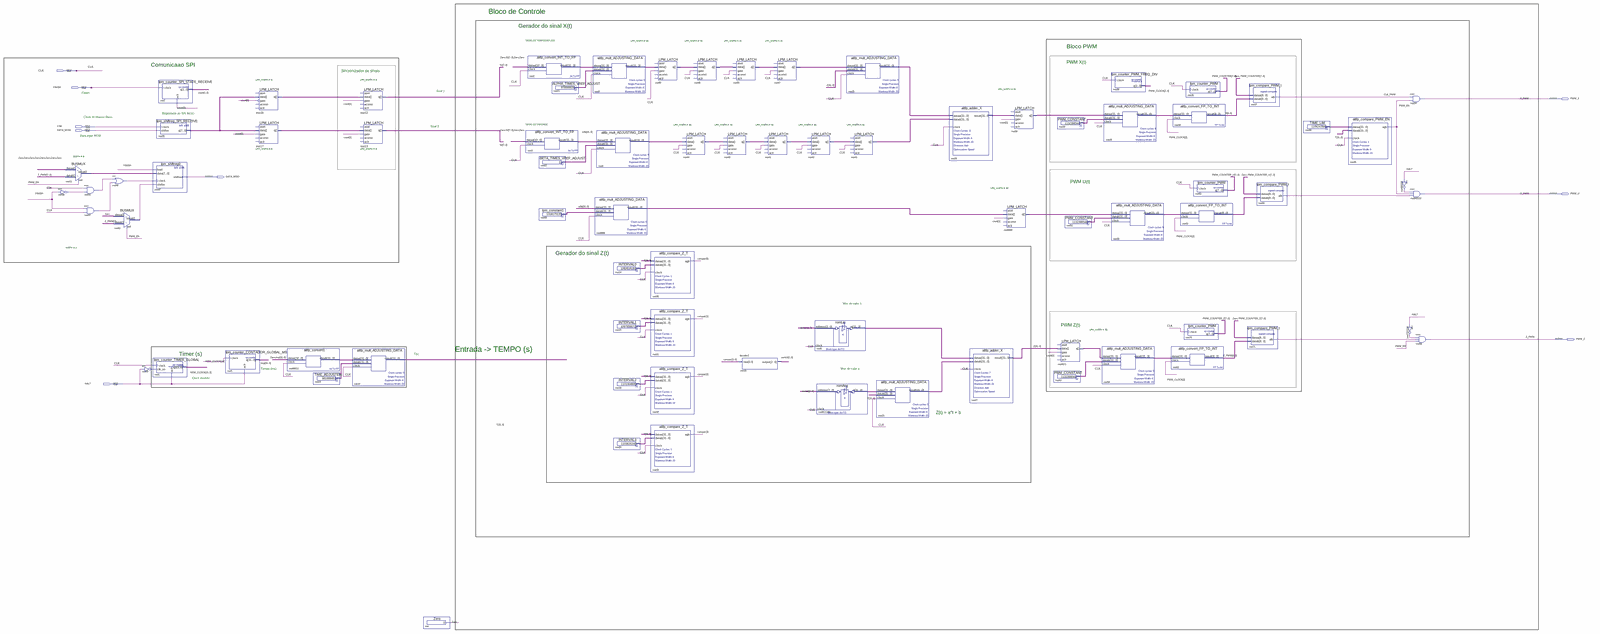
[diagram p0: schematic sheet, whole]
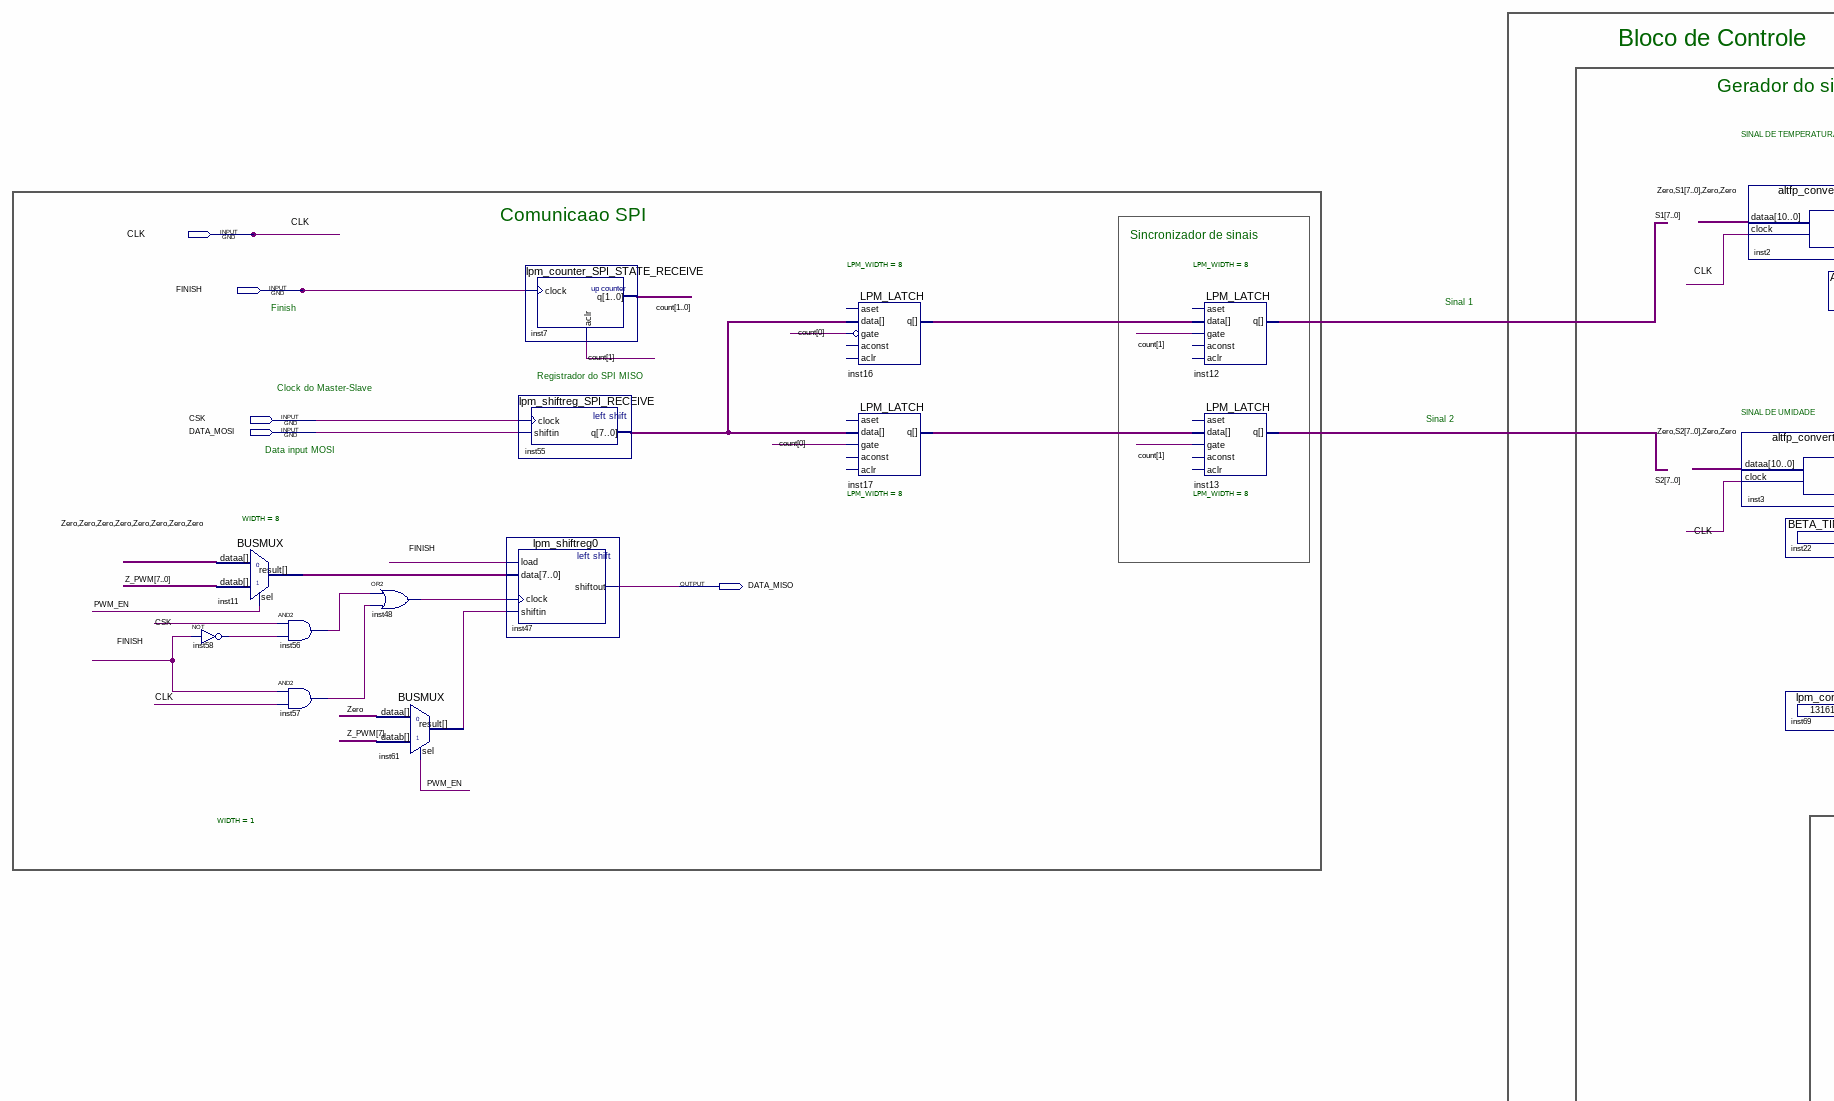
[diagram p1: schematic sheet, upper left part]
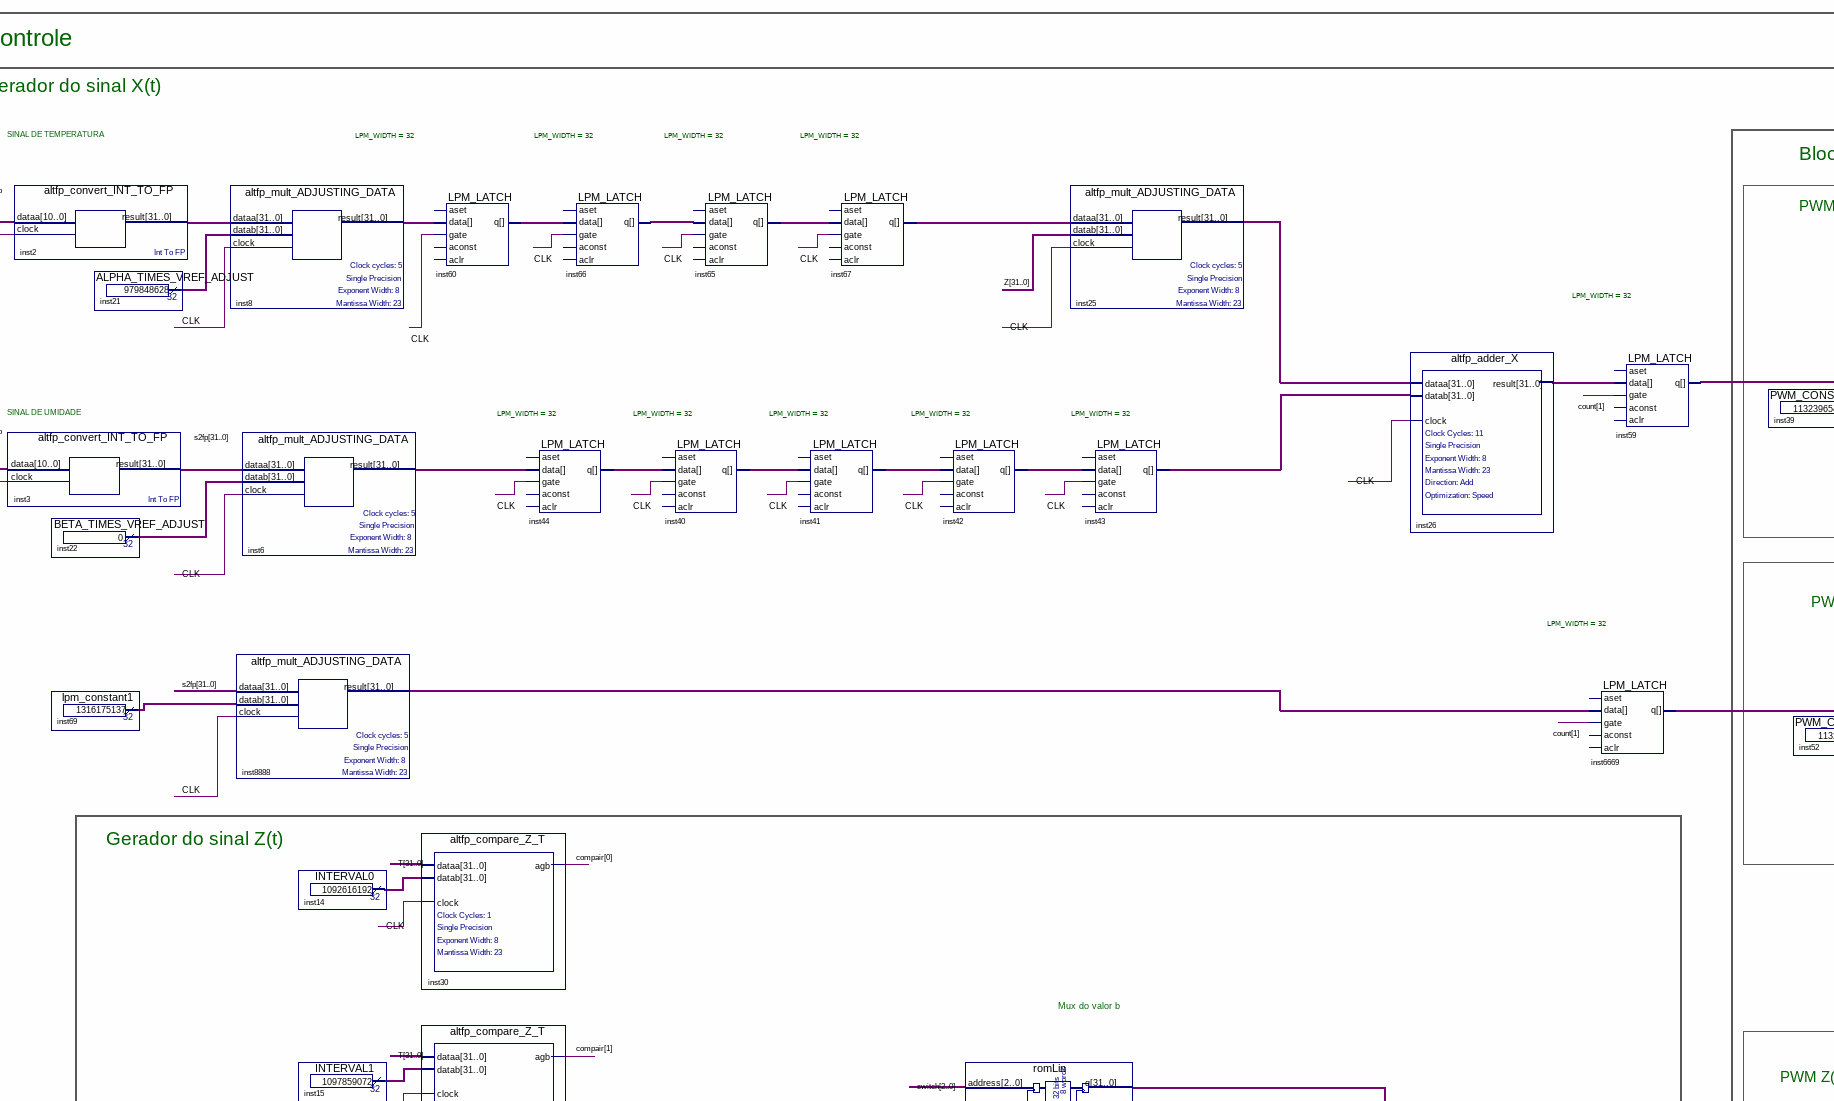
[diagram p2: schematic sheet, upper centre part]
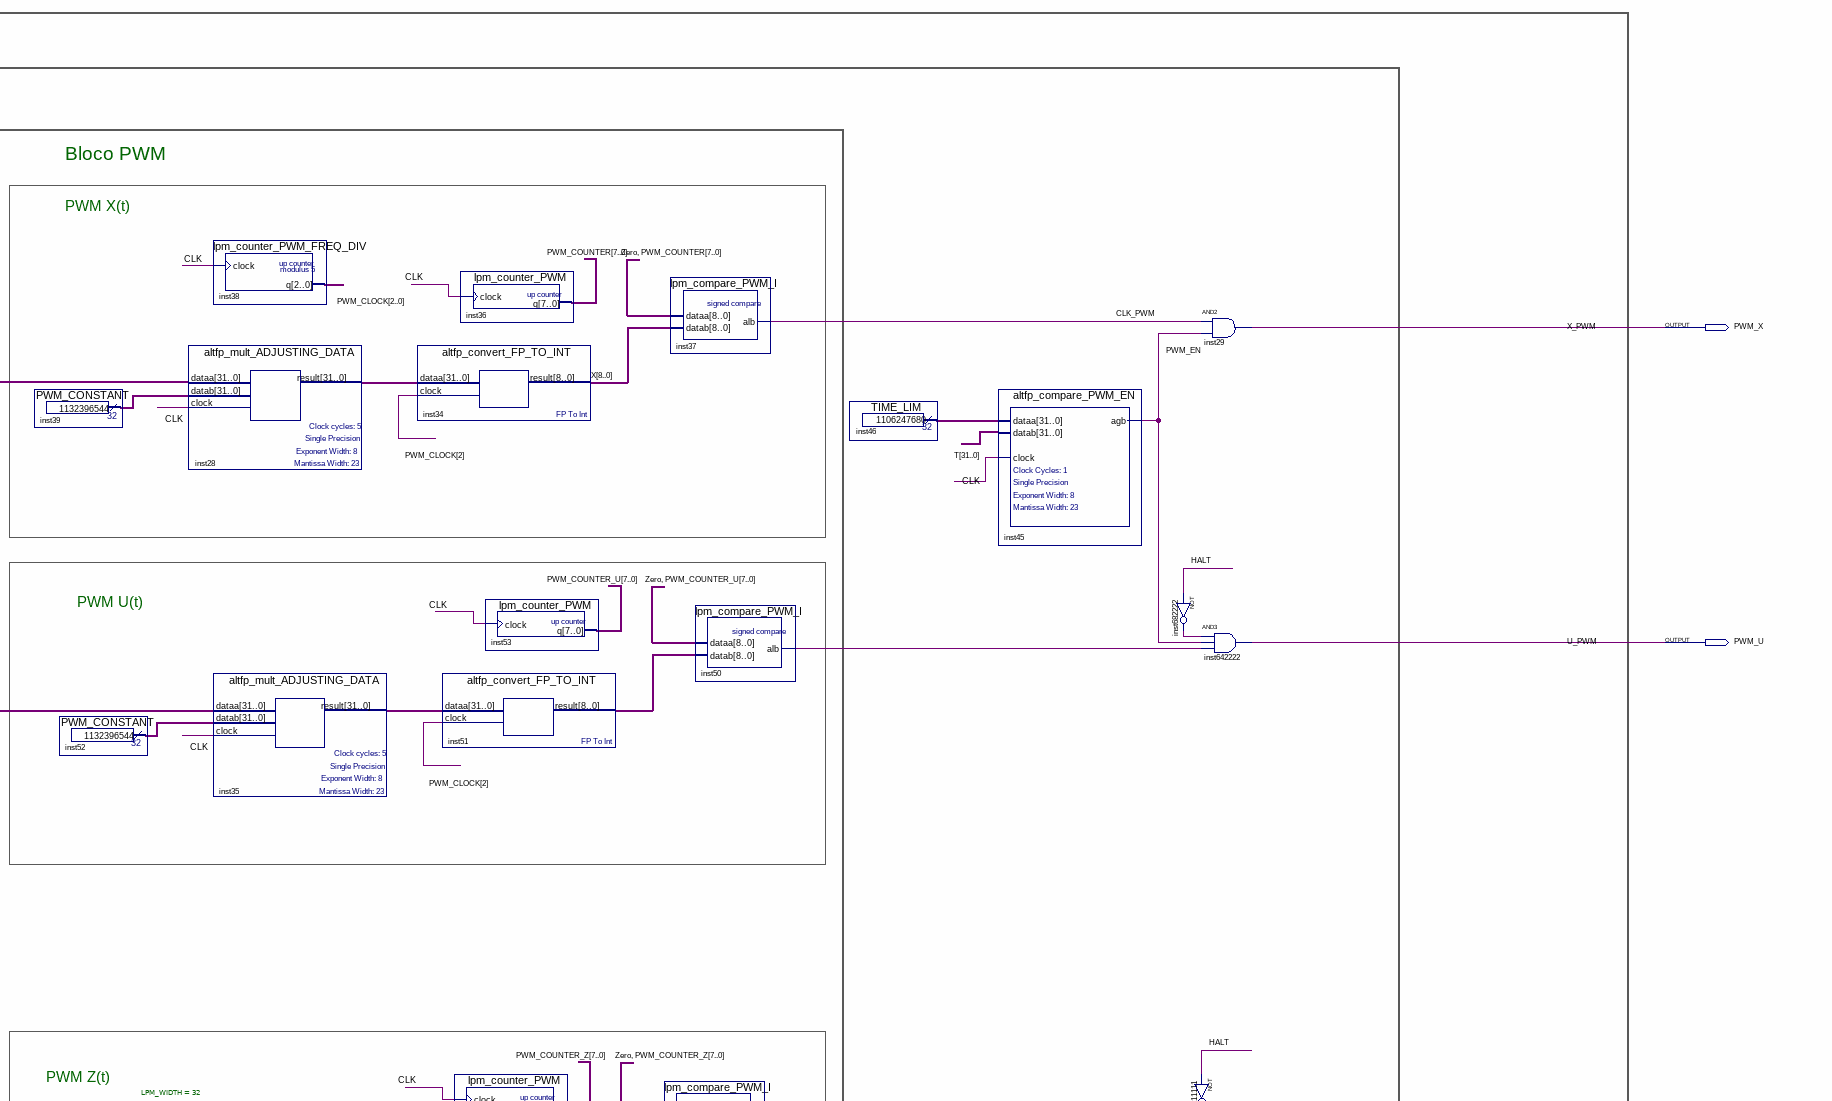
[diagram p3: schematic sheet, upper right part]
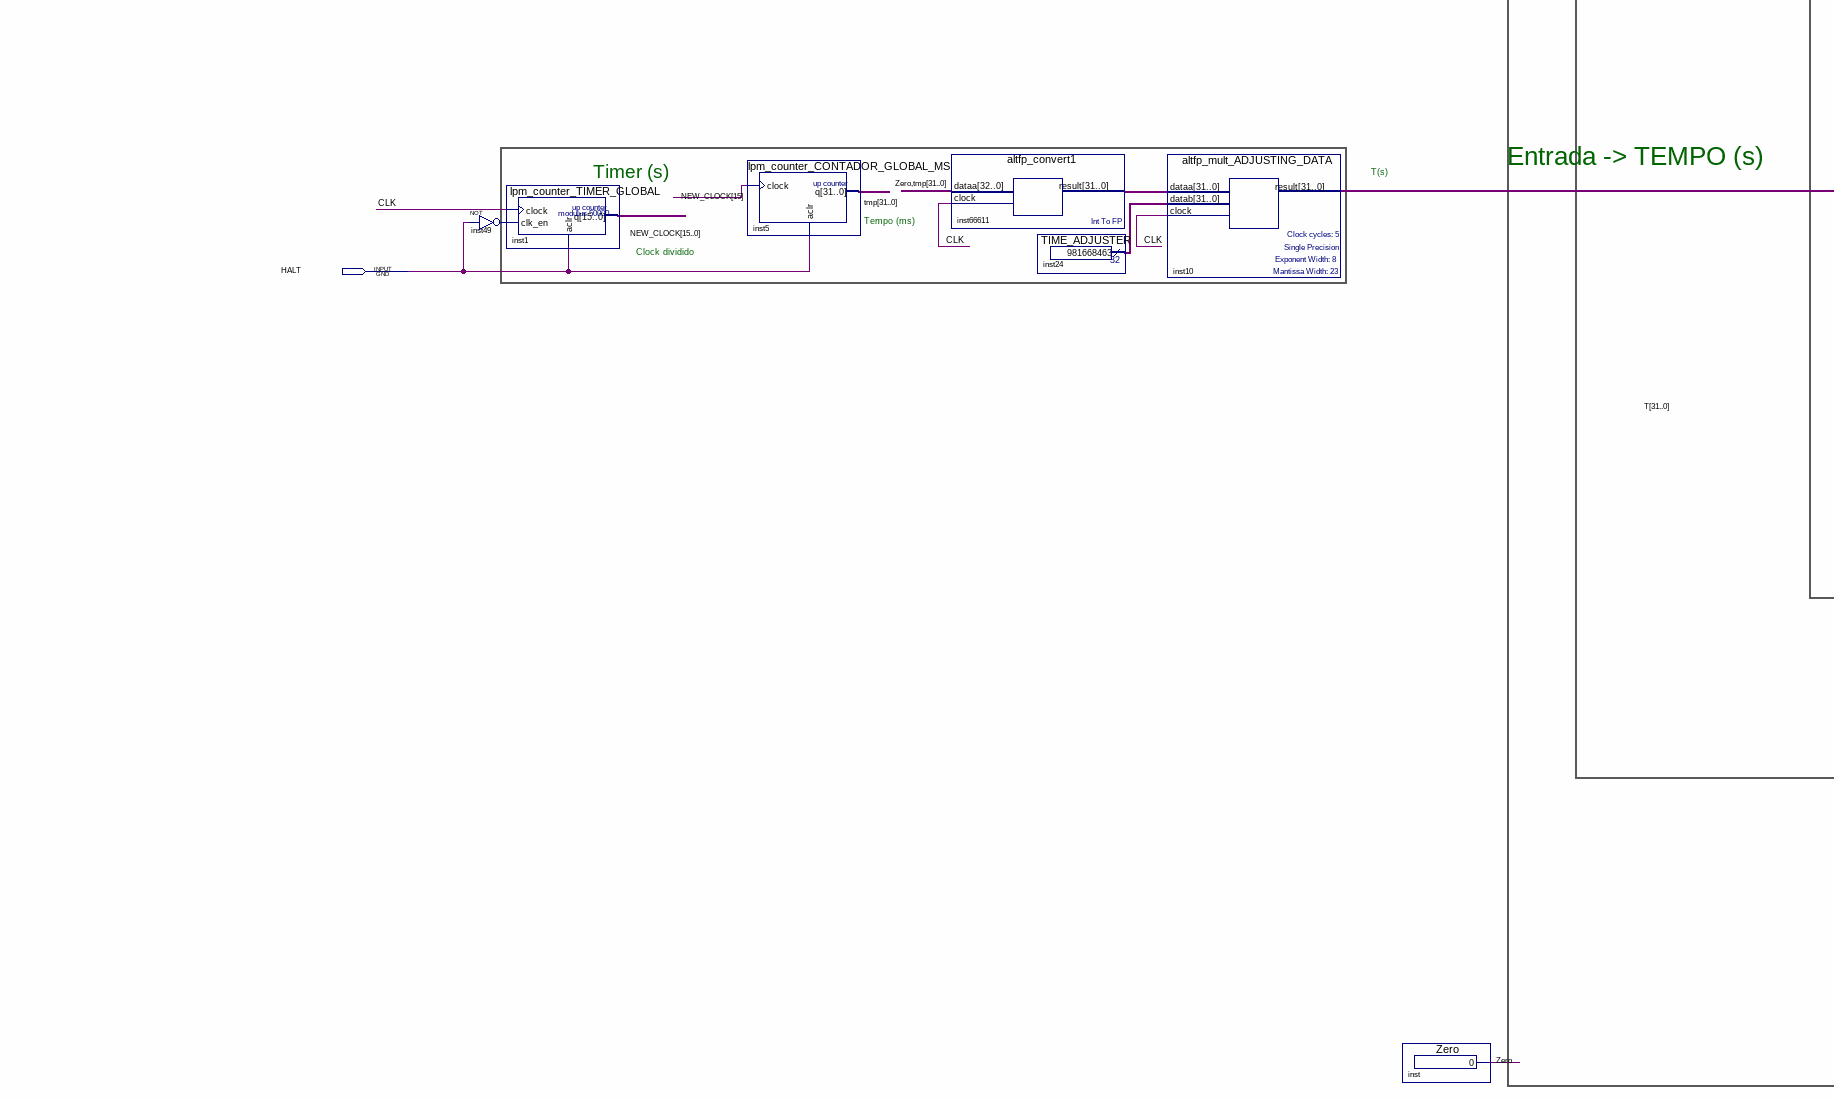
[diagram p4: schematic sheet, lower left part]
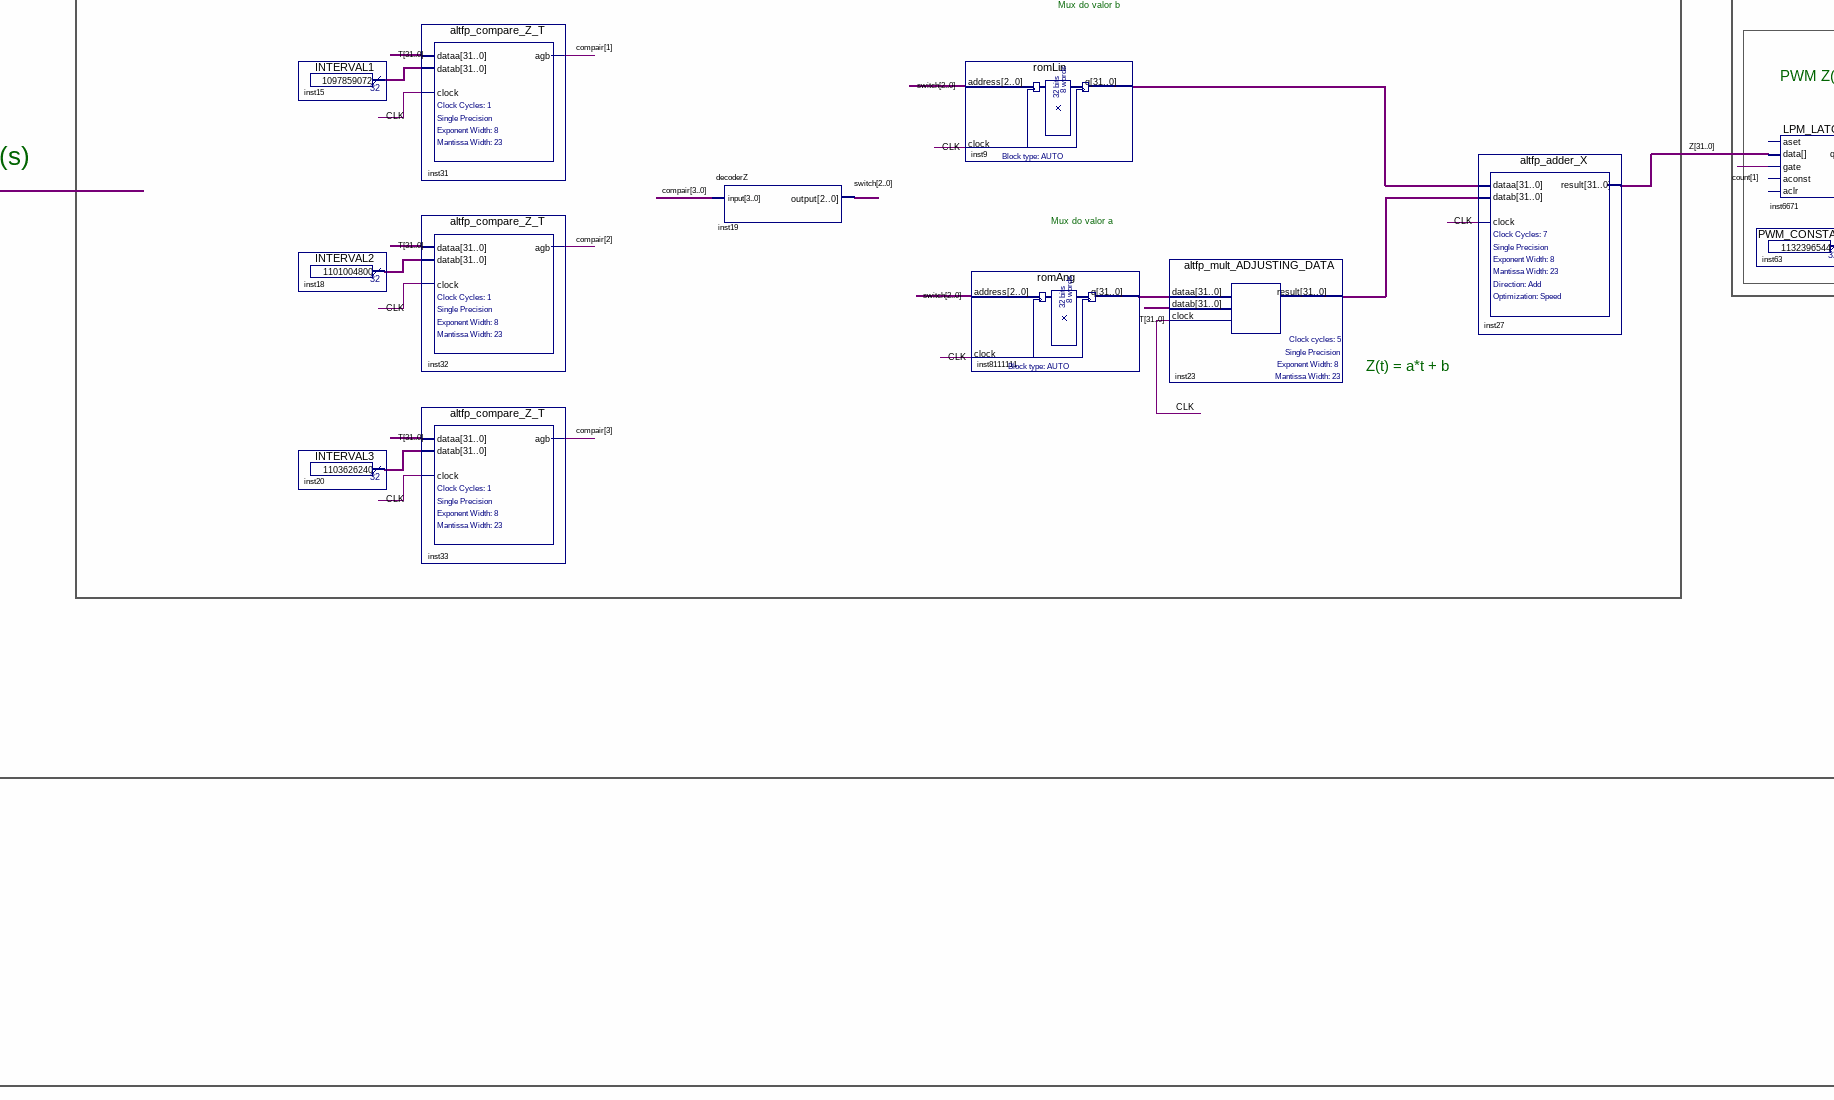
[diagram p5: schematic sheet, lower centre part]
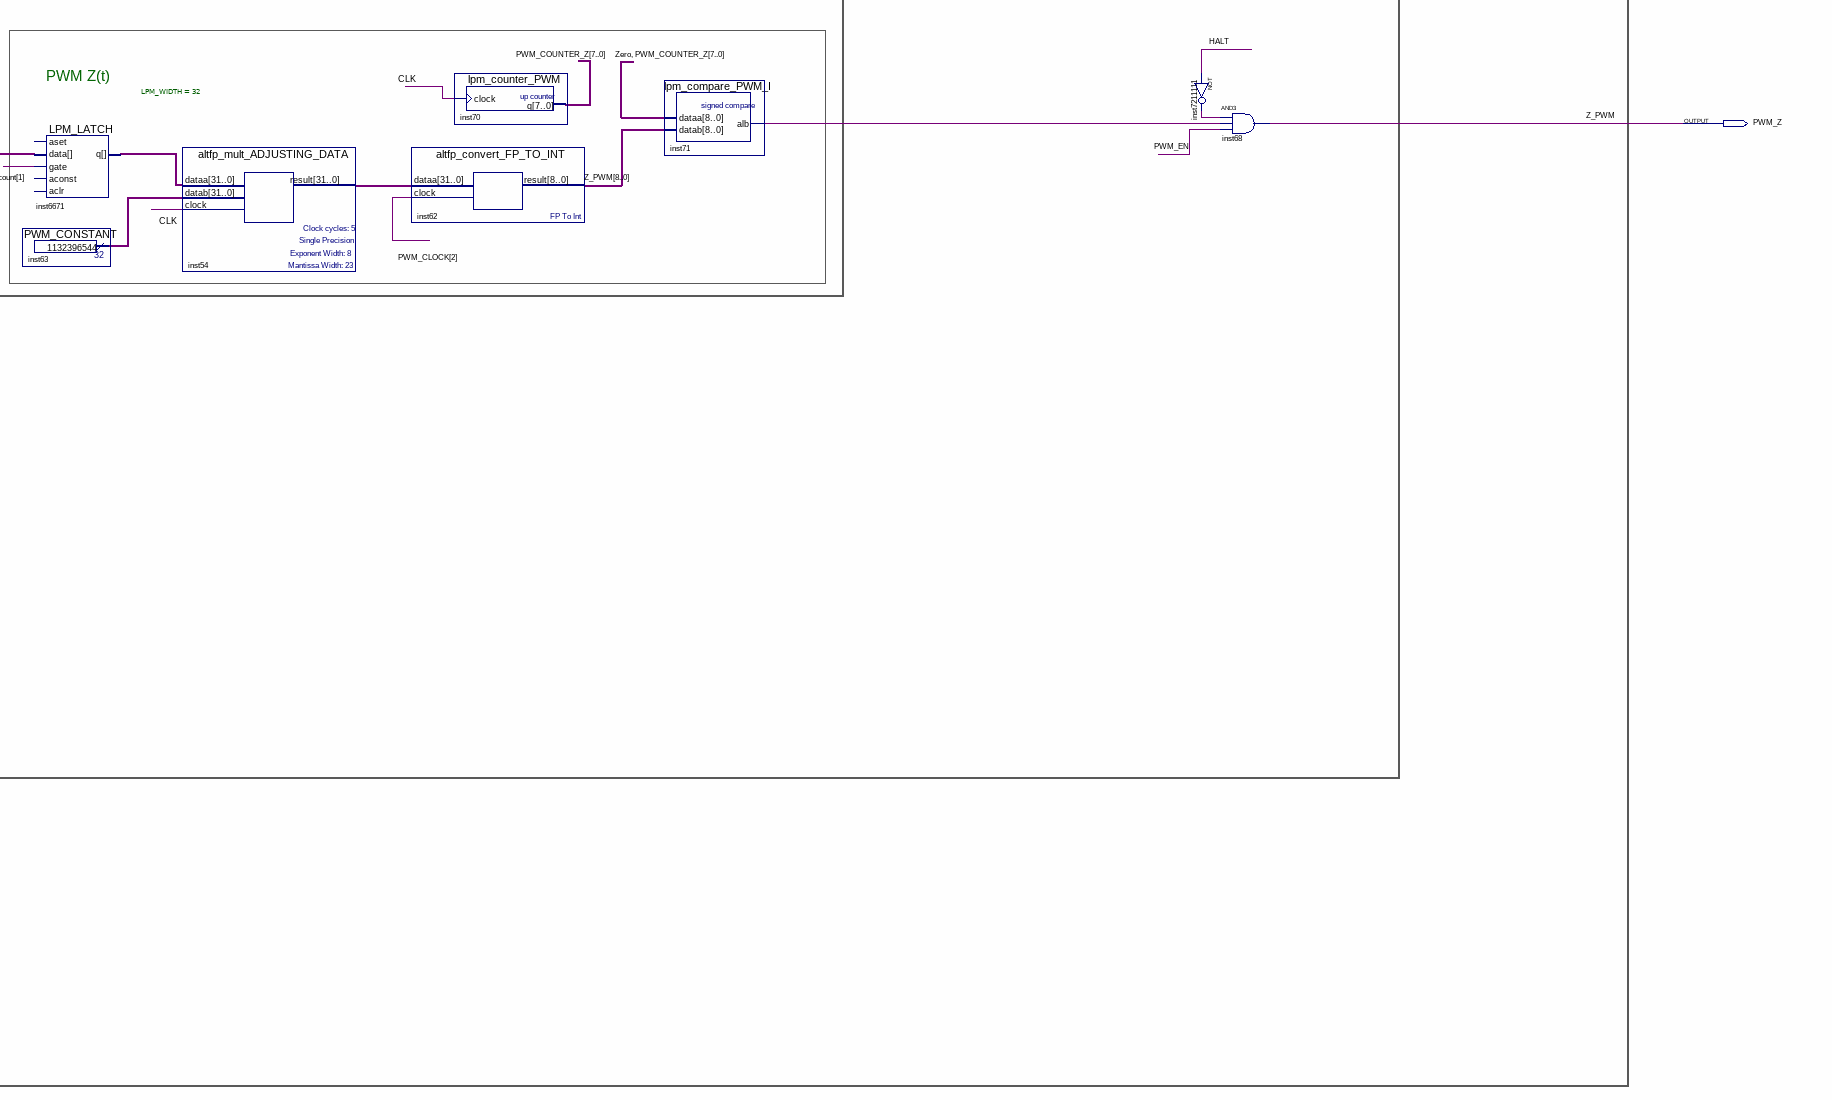
[diagram p6: schematic sheet, lower right part]
// Quartus schematic Secador.bdf as structural Verilog: 78 symbols, 9 pins
module Secador (
  input  CLK,
  input  FINISH,
  input  CSK,
  input  DATA_MOSI,
  input  HALT,
  output PWM_X,
  output DATA_MISO,
  output PWM_U,
  output PWM_Z
);

  wire CLK_PWM, inst48_out, inst49_out, inst50_alb, inst56_out, inst57_out, inst58_out, inst61_result,
       inst71_alb, inst682222_out, inst7211111_out, PWM_EN, Zero;
  wire [1:0] count;
  wire [2:0] PWM_CLOCK, switch;
  wire [3:0] compair;
  wire [7:0] inst11_result, inst16_q, inst17_q, inst55_q, PWM_COUNTER, PWM_COUNTER_U, PWM_COUNTER_Z, S1, S2;
  wire [8:0] inst51_result, X, Z_PWM;
  wire [15:0] NEW_CLOCK;
  wire [31:0] inst2_result, inst6_result, inst8_result, inst9_q, inst14_result, inst15_result, inst18_result,
       inst20_result, inst21_result, inst22_result, inst23_result, inst24_result, inst25_result,
       inst26_result, inst28_result, inst35_result, inst39_result, inst40_q, inst41_q, inst42_q, inst43_q,
       inst44_q, inst46_result, inst52_result, inst54_result, inst59_q, inst60_q, inst63_result, inst65_q,
       inst66_q, inst67_q, inst69_result, inst6669_q, inst6671_q, inst8888_result, inst66611_result,
       inst8111111_q, s2fp, T, tmp, Z;

  BUSMUX #(.WIDTH(8)) inst11 (.datab(Z_PWM[7:0]), .sel(PWM_EN), .dataa({8{Zero}}), .result(inst11_result));
  not inst58 (inst58_out, FINISH);
  and inst56 (inst56_out, CSK, inst58_out);
  and inst57 (inst57_out, FINISH, CLK);
  or inst48 (inst48_out, inst56_out, inst57_out);
  BUSMUX #(.WIDTH(1)) inst61 (.datab(Z_PWM[7]), .sel(PWM_EN), .dataa(Zero), .result(inst61_result));
  not inst49 (inst49_out, HALT);
  lpm_counter_SPI_STATE_RECEIVE inst7 (.clock(FINISH), .aclr(count[1]), .q(count));
  lpm_shiftreg_SPI_RECEIVE inst55 (.clock(CSK), .shiftin(DATA_MOSI), .q(inst55_q));
  lpm_shiftreg0 inst47 (
    .load(FINISH), .data(inst11_result), .clock(inst48_out), .shiftin(inst61_result), .shiftout(DATA_MISO));
  lpm_counter_TIMER_GLOBAL inst1 (.clock(CLK), .clk_en(inst49_out), .aclr(HALT), .q(NEW_CLOCK));
  lpm_counter_CONTADOR_GLOBAL_MS inst5 (.clock(NEW_CLOCK[15]), .aclr(HALT), .q(tmp));
  LPM_LATCH #(.LPM_WIDTH(8)) inst16 (.data(inst55_q), .gate(~count[0]), .q(inst16_q));  // open: aset, aconst, aclr
  LPM_LATCH #(.LPM_WIDTH(8)) inst17 (.data(inst55_q), .gate(count[0]), .q(inst17_q));  // open: aset, aconst, aclr
  altfp_convert1 inst66611 (.dataa({Zero, tmp}), .clock(CLK), .result(inst66611_result));
  TIME_ADJUSTER inst24 (.result(inst24_result));
  altfp_mult_ADJUSTING_DATA inst10 (.dataa(inst66611_result), .datab(inst24_result), .clock(CLK), .result(T));
  LPM_LATCH #(.LPM_WIDTH(8)) inst12 (.data(inst16_q), .gate(count[1]), .q(S1));  // open: aset, aconst, aclr
  LPM_LATCH #(.LPM_WIDTH(8)) inst13 (.data(inst17_q), .gate(count[1]), .q(S2));  // open: aset, aconst, aclr
  Zero inst (.result(Zero));
  altfp_convert_INT_TO_FP inst2 (.dataa({Zero, S1, {2{Zero}}}), .clock(CLK), .result(inst2_result));
  altfp_convert_INT_TO_FP inst3 (.dataa({Zero, S2, {2{Zero}}}), .clock(CLK), .result(s2fp));
  BETA_TIMES_VREF_ADJUST inst22 (.result(inst22_result));
  lpm_constant1 inst69 (.result(inst69_result));
  ALPHA_TIMES_VREF_ADJUST inst21 (.result(inst21_result));
  altfp_mult_ADJUSTING_DATA inst8 (.dataa(inst2_result), .datab(inst21_result), .clock(CLK), .result(inst8_result));
  altfp_mult_ADJUSTING_DATA inst6 (.dataa(s2fp), .datab(inst22_result), .clock(CLK), .result(inst6_result));
  altfp_mult_ADJUSTING_DATA inst8888 (.dataa(s2fp), .datab(inst69_result), .clock(CLK), .result(inst8888_result));
  INTERVAL0 inst14 (.result(inst14_result));
  INTERVAL1 inst15 (.result(inst15_result));
  INTERVAL2 inst18 (.result(inst18_result));
  INTERVAL3 inst20 (.result(inst20_result));
  altfp_compare_Z_T inst30 (.dataa(T), .datab(inst14_result), .clock(CLK), .agb(compair[0]));
  altfp_compare_Z_T inst31 (.dataa(T), .datab(inst15_result), .clock(CLK), .agb(compair[1]));
  altfp_compare_Z_T inst32 (.dataa(T), .datab(inst18_result), .clock(CLK), .agb(compair[2]));
  altfp_compare_Z_T inst33 (.dataa(T), .datab(inst20_result), .clock(CLK), .agb(compair[3]));
  LPM_LATCH #(.LPM_WIDTH(32)) inst60 (.data(inst8_result), .gate(CLK), .q(inst60_q));  // open: aset, aconst, aclr
  LPM_LATCH #(.LPM_WIDTH(32)) inst44 (.data(inst6_result), .gate(CLK), .q(inst44_q));  // open: aset, aconst, aclr
  LPM_LATCH #(.LPM_WIDTH(32)) inst66 (.data(inst60_q), .gate(CLK), .q(inst66_q));  // open: aset, aconst, aclr
  LPM_LATCH #(.LPM_WIDTH(32)) inst40 (.data(inst44_q), .gate(CLK), .q(inst40_q));  // open: aset, aconst, aclr
  LPM_LATCH #(.LPM_WIDTH(32)) inst65 (.data(inst66_q), .gate(CLK), .q(inst65_q));  // open: aset, aconst, aclr
  decoderZ inst19 (.\input (compair), .\output (switch));
  LPM_LATCH #(.LPM_WIDTH(32)) inst41 (.data(inst40_q), .gate(CLK), .q(inst41_q));  // open: aset, aconst, aclr
  LPM_LATCH #(.LPM_WIDTH(32)) inst67 (.data(inst65_q), .gate(CLK), .q(inst67_q));  // open: aset, aconst, aclr
  LPM_LATCH #(.LPM_WIDTH(32)) inst42 (.data(inst41_q), .gate(CLK), .q(inst42_q));  // open: aset, aconst, aclr
  romLin inst9 (.address(switch), .clock(CLK), .q(inst9_q));
  romAng inst8111111 (.address(switch), .clock(CLK), .q(inst8111111_q));
  altfp_mult_ADJUSTING_DATA inst25 (.dataa(inst67_q), .datab(Z), .clock(CLK), .result(inst25_result));
  LPM_LATCH #(.LPM_WIDTH(32)) inst43 (.data(inst42_q), .gate(CLK), .q(inst43_q));  // open: aset, aconst, aclr
  altfp_mult_ADJUSTING_DATA inst23 (.dataa(inst8111111_q), .datab(T), .clock(CLK), .result(inst23_result));
  altfp_adder_X inst26 (.dataa(inst25_result), .datab(inst43_q), .clock(CLK), .result(inst26_result));
  altfp_adder_X inst27 (.dataa(inst9_q), .datab(inst23_result), .clock(CLK), .result(Z));
  LPM_LATCH #(.LPM_WIDTH(32)) inst59 (.data(inst26_result), .gate(count[1]), .q(inst59_q));  // open: aset, aconst, aclr
  LPM_LATCH #(.LPM_WIDTH(32)) inst6669 (
    .data(inst8888_result), .gate(count[1]), .q(inst6669_q));  // open: aset, aconst, aclr
  PWM_CONSTANT inst63 (.result(inst63_result));
  PWM_CONSTANT inst39 (.result(inst39_result));
  PWM_CONSTANT inst52 (.result(inst52_result));
  LPM_LATCH #(.LPM_WIDTH(32)) inst6671 (.data(Z), .gate(count[1]), .q(inst6671_q));  // open: aset, aconst, aclr
  lpm_counter_PWM_FREQ_DIV inst38 (.clock(CLK), .q(PWM_CLOCK));
  altfp_mult_ADJUSTING_DATA inst28 (.dataa(inst59_q), .datab(inst39_result), .clock(CLK), .result(inst28_result));
  altfp_mult_ADJUSTING_DATA inst35 (.dataa(inst6669_q), .datab(inst52_result), .clock(CLK), .result(inst35_result));
  altfp_mult_ADJUSTING_DATA inst54 (.dataa(inst6671_q), .datab(inst63_result), .clock(CLK), .result(inst54_result));
  altfp_convert_FP_TO_INT inst34 (.dataa(inst28_result), .clock(PWM_CLOCK[2]), .result(X));
  altfp_convert_FP_TO_INT inst62 (.dataa(inst54_result), .clock(PWM_CLOCK[2]), .result(Z_PWM));
  lpm_counter_PWM inst36 (.clock(CLK), .q(PWM_COUNTER));
  altfp_convert_FP_TO_INT inst51 (.dataa(inst35_result), .clock(PWM_CLOCK[2]), .result(inst51_result));
  lpm_counter_PWM inst70 (.clock(CLK), .q(PWM_COUNTER_Z));
  lpm_counter_PWM inst53 (.clock(CLK), .q(PWM_COUNTER_U));
  lpm_compare_PWM_I inst37 (.dataa({Zero, PWM_COUNTER}), .datab(X), .alb(CLK_PWM));
  lpm_compare_PWM_I inst71 (.dataa({Zero, PWM_COUNTER_Z}), .datab(Z_PWM), .alb(inst71_alb));
  lpm_compare_PWM_I inst50 (.dataa({Zero, PWM_COUNTER_U}), .datab(inst51_result), .alb(inst50_alb));
  TIME_LIM inst46 (.result(inst46_result));
  altfp_compare_PWM_EN inst45 (.dataa(inst46_result), .datab(T), .clock(CLK), .agb(PWM_EN));
  and inst29 (PWM_X, CLK_PWM, PWM_EN);
  not inst682222 (inst682222_out, HALT);
  and inst642222 (PWM_U, inst682222_out, PWM_EN, inst50_alb);
  not inst7211111 (inst7211111_out, HALT);
  and inst68 (PWM_Z, inst7211111_out, inst71_alb, PWM_EN);

  // Other names for the same wires on the sheet: U_PWM = PWM_U; X_PWM = PWM_X; Z_PWM = PWM_Z

  // Notes on the sheet:
  //   Bloco de Controle
  //   Gerador do sinal X(t)
  //   SINAL DE TEMPERATURA
  //   Bloco PWM
  //   PWM X(t)
  //   Comunicaao SPI
  //   Sincronizador de sinais
  //   Sinal 1
  //   Finish
  //   Registrador do SPI MISO
  //   Clock do Master-Slave
  //   SINAL DE UMIDADE
  //   Sinal 2
  //   Data input MOSI
  //   PWM U(t)
  //   Gerador do sinal Z(t)
  //   Mux do valor b
  //   PWM Z(t)
  //   Entrada -> TEMPO (s)
  //   Timer (s)
  //   T(s)
  //   Tempo (ms)
  //   Mux do valor a
  //   Clock dividido
  //   Z(t) = a*t + b
endmodule
